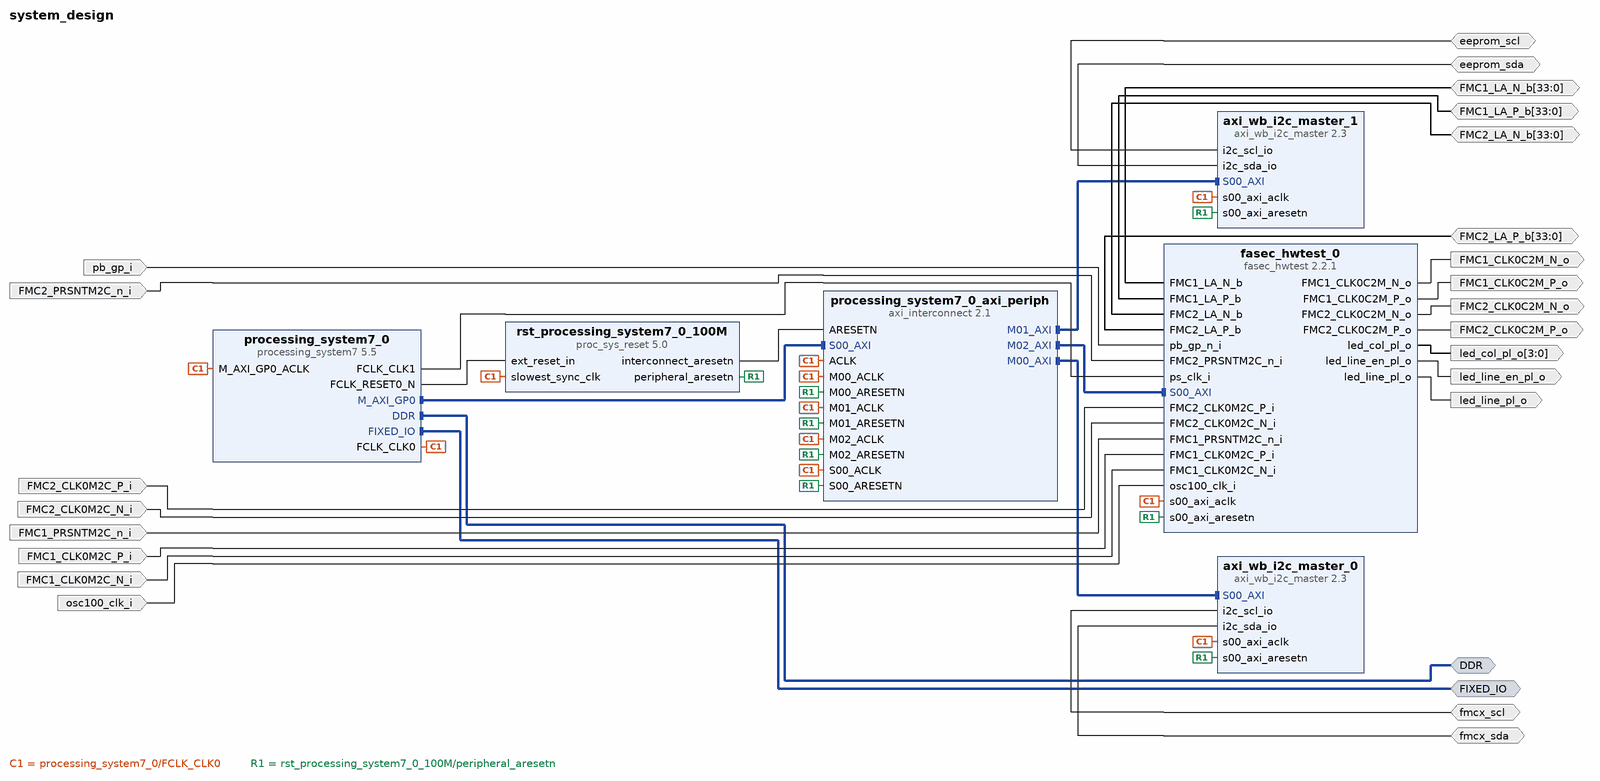
[diagram p0: block diagram of the top level]
# Vivado block design system_design, Vivado 2016.2
create_bd_design system_design

create_bd_intf_port -mode Master -vlnv xilinx.com:interface:ddrx_rtl:1.0 DDR
create_bd_intf_port -mode Master -vlnv xilinx.com:display_processing_system7:fixedio_rtl:1.0 FIXED_IO
create_bd_port -dir I pb_gp_i
create_bd_port -dir O -from 3 -to 0 led_col_pl_o
create_bd_port -dir O led_line_en_pl_o
create_bd_port -dir O led_line_pl_o
create_bd_port -dir IO fmcx_scl
create_bd_port -dir IO fmcx_sda
create_bd_port -dir IO eeprom_scl
create_bd_port -dir IO eeprom_sda
create_bd_port -dir IO -from 33 -to 0 FMC2_LA_P_b
create_bd_port -dir IO -from 33 -to 0 FMC2_LA_N_b
create_bd_port -dir IO -from 33 -to 0 FMC1_LA_P_b
create_bd_port -dir IO -from 33 -to 0 FMC1_LA_N_b
create_bd_port -dir I FMC2_PRSNTM2C_n_i
create_bd_port -dir I FMC2_CLK0M2C_P_i
create_bd_port -dir I FMC2_CLK0M2C_N_i
create_bd_port -dir I FMC1_PRSNTM2C_n_i
create_bd_port -dir I FMC1_CLK0M2C_P_i
create_bd_port -dir I FMC1_CLK0M2C_N_i
create_bd_port -dir O FMC2_CLK0C2M_P_o
create_bd_port -dir O FMC2_CLK0C2M_N_o
create_bd_port -dir O FMC1_CLK0C2M_P_o
create_bd_port -dir O FMC1_CLK0C2M_N_o
create_bd_port -dir I osc100_clk_i

create_bd_cell -type ip -vlnv xilinx.com:ip:processing_system7:5.5 processing_system7_0
set_property -dict [list \
  CONFIG.PCW_QSPI_PERIPHERAL_FREQMHZ 125 \
  CONFIG.PCW_SDIO_PERIPHERAL_FREQMHZ 25 \
  CONFIG.PCW_FPGA0_PERIPHERAL_FREQMHZ 100 \
  CONFIG.PCW_FPGA1_PERIPHERAL_FREQMHZ 100 \
  CONFIG.PCW_EN_CLK1_PORT 1 \
  CONFIG.PCW_PRESET_BANK1_VOLTAGE {LVCMOS 3.3V} \
  CONFIG.PCW_UIPARAM_DDR_MEMORY_TYPE {DDR 3 (Low Voltage)} \
  CONFIG.PCW_UIPARAM_DDR_PARTNO {MT41K256M16 RE-125} \
  CONFIG.PCW_QSPI_PERIPHERAL_ENABLE 1 \
  CONFIG.PCW_QSPI_GRP_SINGLE_SS_ENABLE 0 \
  CONFIG.PCW_QSPI_GRP_IO1_ENABLE 1 \
  CONFIG.PCW_QSPI_GRP_FBCLK_ENABLE 1 \
  CONFIG.PCW_ENET0_PERIPHERAL_ENABLE 1 \
  CONFIG.PCW_ENET0_ENET0_IO {MIO 16 .. 27} \
  CONFIG.PCW_ENET0_GRP_MDIO_ENABLE 1 \
  CONFIG.PCW_ENET_RESET_ENABLE 1 \
  CONFIG.PCW_SD0_PERIPHERAL_ENABLE 1 \
  CONFIG.PCW_SD0_GRP_CD_ENABLE 1 \
  CONFIG.PCW_SD0_GRP_CD_IO {MIO 46} \
  CONFIG.PCW_SD0_GRP_WP_ENABLE 1 \
  CONFIG.PCW_SD0_GRP_WP_IO {MIO 47} \
  CONFIG.PCW_UART1_PERIPHERAL_ENABLE 1 \
  CONFIG.PCW_TTC0_PERIPHERAL_ENABLE 1 \
  CONFIG.PCW_USB_RESET_ENABLE 0 \
  CONFIG.PCW_I2C0_PERIPHERAL_ENABLE 1 \
  CONFIG.PCW_I2C0_I2C0_IO {MIO 30 .. 31} \
  CONFIG.PCW_I2C_RESET_ENABLE 1 \
  CONFIG.PCW_GPIO_MIO_GPIO_ENABLE 1 \
  CONFIG.PCW_UIPARAM_GENERATE_SUMMARY NONE \
] [get_bd_cells processing_system7_0]
# 61 more settings of processing_system7_0 are not shown: defaults, MIO pin electricals, DDR timing, and values the tool derives
create_bd_cell -type ip -vlnv xilinx.com:ip:axi_interconnect:2.1 processing_system7_0_axi_periph
set_property -dict {CONFIG.NUM_MI 3} [get_bd_cells processing_system7_0_axi_periph]
create_bd_cell -type ip -vlnv xilinx.com:ip:proc_sys_reset:5.0 rst_processing_system7_0_100M
create_bd_cell -type ip -vlnv user.org:user:axi_wb_i2c_master:2.3 axi_wb_i2c_master_0
create_bd_cell -type ip -vlnv user.org:user:axi_wb_i2c_master:2.3 axi_wb_i2c_master_1
create_bd_cell -type ip -vlnv user.org:user:fasec_hwtest:2.2.1 fasec_hwtest_0

# ---- connections ----

connect_bd_intf_net [get_bd_intf_pins processing_system7_0/M_AXI_GP0] [get_bd_intf_pins processing_system7_0_axi_periph/S00_AXI]
connect_bd_intf_net [get_bd_intf_pins processing_system7_0_axi_periph/M00_AXI] [get_bd_intf_pins axi_wb_i2c_master_0/S00_AXI]
connect_bd_intf_net [get_bd_intf_pins processing_system7_0_axi_periph/M01_AXI] [get_bd_intf_pins axi_wb_i2c_master_1/S00_AXI]
connect_bd_intf_net [get_bd_intf_pins processing_system7_0_axi_periph/M02_AXI] [get_bd_intf_pins fasec_hwtest_0/S00_AXI]
connect_bd_intf_net [get_bd_intf_ports DDR] [get_bd_intf_pins processing_system7_0/DDR]
connect_bd_intf_net [get_bd_intf_ports FIXED_IO] [get_bd_intf_pins processing_system7_0/FIXED_IO]
connect_bd_net [get_bd_ports pb_gp_i] [get_bd_pins fasec_hwtest_0/pb_gp_n_i]
connect_bd_net [get_bd_pins fasec_hwtest_0/led_col_pl_o] [get_bd_ports led_col_pl_o]
connect_bd_net [get_bd_pins fasec_hwtest_0/led_line_en_pl_o] [get_bd_ports led_line_en_pl_o]
connect_bd_net [get_bd_pins fasec_hwtest_0/led_line_pl_o] [get_bd_ports led_line_pl_o]
connect_bd_net [get_bd_pins processing_system7_0/FCLK_CLK1] [get_bd_pins fasec_hwtest_0/ps_clk_i]
connect_bd_net [get_bd_pins processing_system7_0/FCLK_CLK0] \
  [get_bd_pins processing_system7_0/M_AXI_GP0_ACLK] [get_bd_pins rst_processing_system7_0_100M/slowest_sync_clk] \
  [get_bd_pins axi_wb_i2c_master_0/s00_axi_aclk] [get_bd_pins axi_wb_i2c_master_1/s00_axi_aclk] \
  [get_bd_pins processing_system7_0_axi_periph/S00_ACLK] [get_bd_pins processing_system7_0_axi_periph/ACLK] \
  [get_bd_pins processing_system7_0_axi_periph/M00_ACLK] [get_bd_pins processing_system7_0_axi_periph/M01_ACLK] \
  [get_bd_pins processing_system7_0_axi_periph/M02_ACLK] [get_bd_pins fasec_hwtest_0/s00_axi_aclk]
connect_bd_net [get_bd_pins processing_system7_0/FCLK_RESET0_N] [get_bd_pins rst_processing_system7_0_100M/ext_reset_in]
connect_bd_net [get_bd_pins rst_processing_system7_0_100M/peripheral_aresetn] \
  [get_bd_pins axi_wb_i2c_master_0/s00_axi_aresetn] [get_bd_pins axi_wb_i2c_master_1/s00_axi_aresetn] \
  [get_bd_pins processing_system7_0_axi_periph/S00_ARESETN] [get_bd_pins processing_system7_0_axi_periph/M00_ARESETN] \
  [get_bd_pins processing_system7_0_axi_periph/M01_ARESETN] [get_bd_pins processing_system7_0_axi_periph/M02_ARESETN] \
  [get_bd_pins fasec_hwtest_0/s00_axi_aresetn]
connect_bd_net [get_bd_pins rst_processing_system7_0_100M/interconnect_aresetn] [get_bd_pins processing_system7_0_axi_periph/ARESETN]
connect_bd_net [get_bd_ports fmcx_scl] [get_bd_pins axi_wb_i2c_master_0/i2c_scl_io]
connect_bd_net [get_bd_ports fmcx_sda] [get_bd_pins axi_wb_i2c_master_0/i2c_sda_io]
connect_bd_net [get_bd_ports eeprom_scl] [get_bd_pins axi_wb_i2c_master_1/i2c_scl_io]
connect_bd_net [get_bd_ports eeprom_sda] [get_bd_pins axi_wb_i2c_master_1/i2c_sda_io]
connect_bd_net [get_bd_ports FMC2_LA_P_b] [get_bd_pins fasec_hwtest_0/FMC2_LA_P_b]
connect_bd_net [get_bd_ports FMC2_LA_N_b] [get_bd_pins fasec_hwtest_0/FMC2_LA_N_b]
connect_bd_net [get_bd_ports FMC1_LA_P_b] [get_bd_pins fasec_hwtest_0/FMC1_LA_P_b]
connect_bd_net [get_bd_ports FMC1_LA_N_b] [get_bd_pins fasec_hwtest_0/FMC1_LA_N_b]
connect_bd_net [get_bd_ports FMC2_PRSNTM2C_n_i] [get_bd_pins fasec_hwtest_0/FMC2_PRSNTM2C_n_i]
connect_bd_net [get_bd_ports FMC2_CLK0M2C_P_i] [get_bd_pins fasec_hwtest_0/FMC2_CLK0M2C_P_i]
connect_bd_net [get_bd_ports FMC2_CLK0M2C_N_i] [get_bd_pins fasec_hwtest_0/FMC2_CLK0M2C_N_i]
connect_bd_net [get_bd_ports FMC1_PRSNTM2C_n_i] [get_bd_pins fasec_hwtest_0/FMC1_PRSNTM2C_n_i]
connect_bd_net [get_bd_ports FMC1_CLK0M2C_P_i] [get_bd_pins fasec_hwtest_0/FMC1_CLK0M2C_P_i]
connect_bd_net [get_bd_ports FMC1_CLK0M2C_N_i] [get_bd_pins fasec_hwtest_0/FMC1_CLK0M2C_N_i]
connect_bd_net [get_bd_pins fasec_hwtest_0/FMC2_CLK0C2M_P_o] [get_bd_ports FMC2_CLK0C2M_P_o]
connect_bd_net [get_bd_pins fasec_hwtest_0/FMC2_CLK0C2M_N_o] [get_bd_ports FMC2_CLK0C2M_N_o]
connect_bd_net [get_bd_pins fasec_hwtest_0/FMC1_CLK0C2M_P_o] [get_bd_ports FMC1_CLK0C2M_P_o]
connect_bd_net [get_bd_pins fasec_hwtest_0/FMC1_CLK0C2M_N_o] [get_bd_ports FMC1_CLK0C2M_N_o]
connect_bd_net [get_bd_ports osc100_clk_i] [get_bd_pins fasec_hwtest_0/osc100_clk_i]

# ---- address map ----
assign_bd_address -offset 0x43C00000 -range 64K -target_address_space [get_bd_addr_spaces processing_system7_0/Data] [get_bd_addr_segs axi_wb_i2c_master_0/S00_AXI/S00_AXI_reg]
assign_bd_address -offset 0x43C10000 -range 64K -target_address_space [get_bd_addr_spaces processing_system7_0/Data] [get_bd_addr_segs axi_wb_i2c_master_1/S00_AXI/S00_AXI_reg]
assign_bd_address -offset 0x43C20000 -range 64K -target_address_space [get_bd_addr_spaces processing_system7_0/Data] [get_bd_addr_segs fasec_hwtest_0/S00_AXI/S00_AXI_reg]

validate_bd_design
save_bd_design
